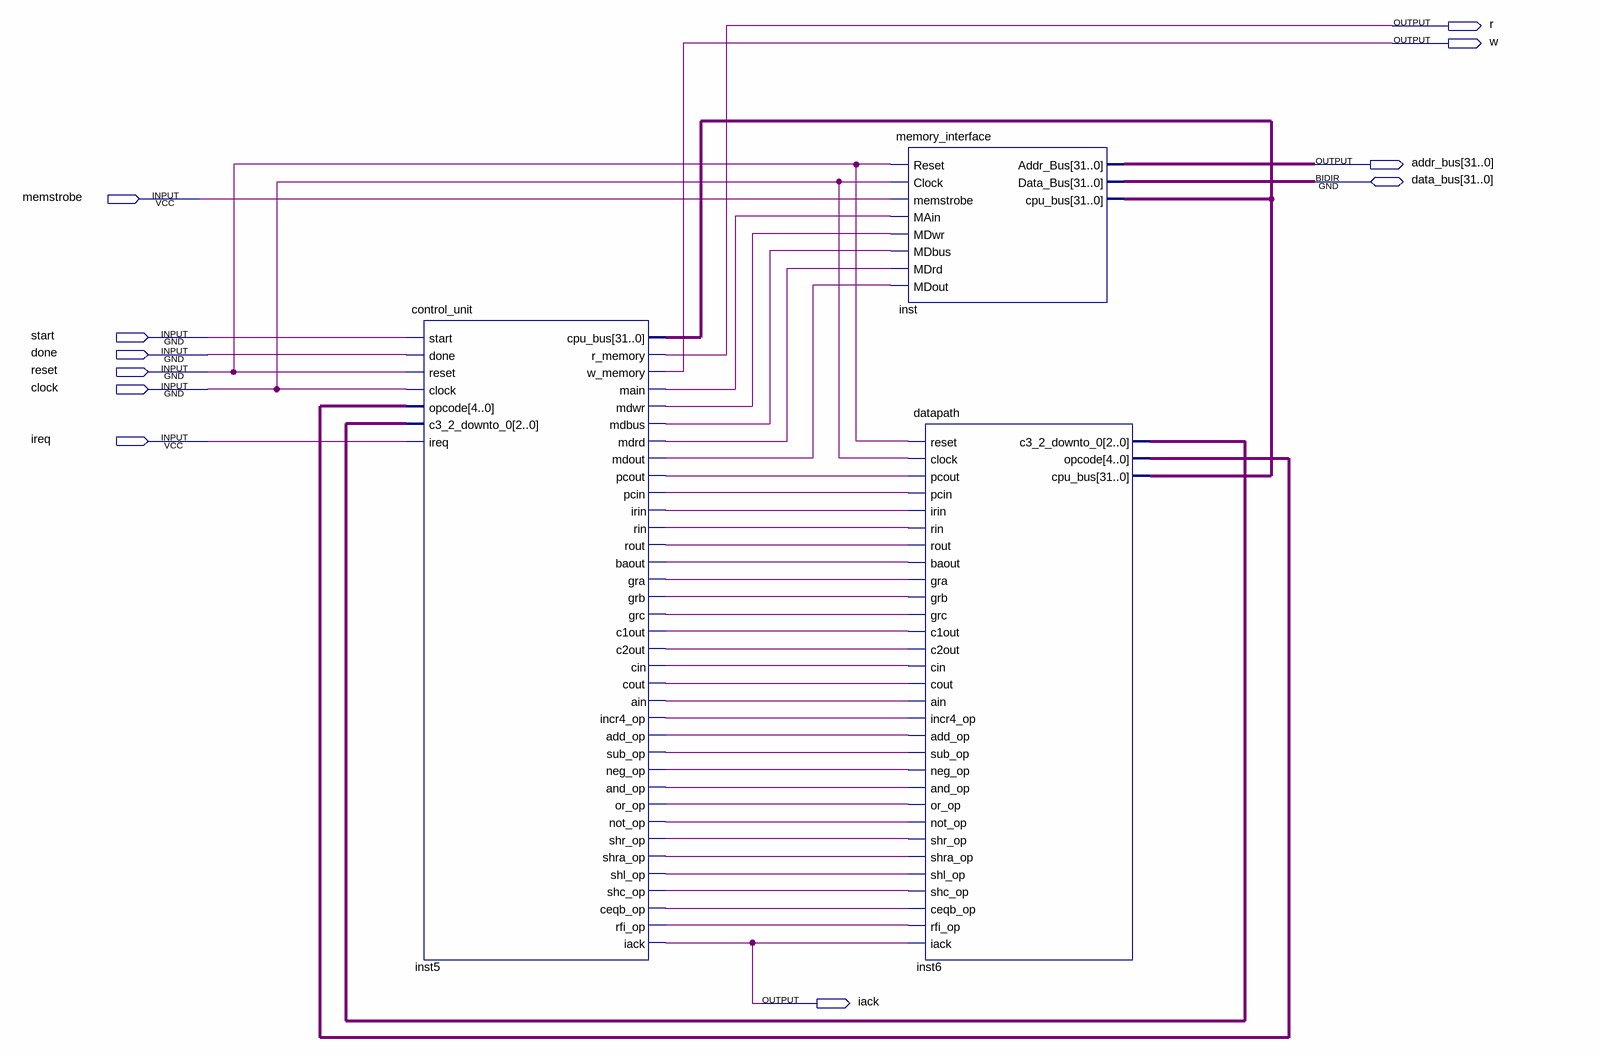
[diagram p0: schematic sheet]
// Quartus schematic cpu.bdf as structural Verilog: 3 symbols, 11 pins
module cpu (
  input  memstrobe,
  input  start,
  input  done,
  input  reset,
  input  clock,
  input  ireq,
  inout  [31:0] data_bus,
  output r,
  output w,
  output [31:0] addr_bus,
  output iack
);

  wire inst5_add_op, inst5_ain, inst5_and_op, inst5_baout, inst5_c1out, inst5_c2out, inst5_ceqb_op,
       inst5_cin, inst5_cout, inst5_gra, inst5_grb, inst5_grc, inst5_incr4_op, inst5_irin, inst5_main,
       inst5_mdbus, inst5_mdout, inst5_mdrd, inst5_mdwr, inst5_neg_op, inst5_not_op, inst5_or_op, inst5_pcin,
       inst5_pcout, inst5_rfi_op, inst5_rin, inst5_rout, inst5_shc_op, inst5_shl_op, inst5_shr_op,
       inst5_shra_op, inst5_sub_op;
  wire [2:0] inst6_c3_2_downto_0;
  wire [4:0] inst6_opcode;
  wire [31:0] inst5_cpu_bus;

  control_unit inst5 (
    .start(start), .done(done), .reset(reset), .clock(clock), .opcode(inst6_opcode),
    .c3_2_downto_0(inst6_c3_2_downto_0), .ireq(ireq), .r_memory(r), .w_memory(w), .main(inst5_main),
    .mdwr(inst5_mdwr), .mdbus(inst5_mdbus), .mdrd(inst5_mdrd), .mdout(inst5_mdout), .pcout(inst5_pcout),
    .pcin(inst5_pcin), .irin(inst5_irin), .rin(inst5_rin), .rout(inst5_rout), .baout(inst5_baout),
    .gra(inst5_gra), .grb(inst5_grb), .grc(inst5_grc), .c1out(inst5_c1out), .c2out(inst5_c2out),
    .cin(inst5_cin), .cout(inst5_cout), .ain(inst5_ain), .incr4_op(inst5_incr4_op), .add_op(inst5_add_op),
    .sub_op(inst5_sub_op), .neg_op(inst5_neg_op), .and_op(inst5_and_op), .or_op(inst5_or_op),
    .not_op(inst5_not_op), .shr_op(inst5_shr_op), .shra_op(inst5_shra_op), .shl_op(inst5_shl_op),
    .shc_op(inst5_shc_op), .ceqb_op(inst5_ceqb_op), .rfi_op(inst5_rfi_op), .iack(iack),
    .cpu_bus(inst5_cpu_bus));
  memory_interface inst (
    .Reset(reset), .Clock(clock), .memstrobe(memstrobe), .MAin(inst5_main), .MDwr(inst5_mdwr),
    .MDbus(inst5_mdbus), .MDrd(inst5_mdrd), .MDout(inst5_mdout), .Addr_Bus(addr_bus), .Data_Bus(data_bus),
    .cpu_bus(inst5_cpu_bus));
  datapath inst6 (
    .reset(reset), .clock(clock), .pcout(inst5_pcout), .pcin(inst5_pcin), .irin(inst5_irin), .rin(inst5_rin),
    .rout(inst5_rout), .baout(inst5_baout), .gra(inst5_gra), .grb(inst5_grb), .grc(inst5_grc),
    .c1out(inst5_c1out), .c2out(inst5_c2out), .cin(inst5_cin), .cout(inst5_cout), .ain(inst5_ain),
    .incr4_op(inst5_incr4_op), .add_op(inst5_add_op), .sub_op(inst5_sub_op), .neg_op(inst5_neg_op),
    .and_op(inst5_and_op), .or_op(inst5_or_op), .not_op(inst5_not_op), .shr_op(inst5_shr_op),
    .shra_op(inst5_shra_op), .shl_op(inst5_shl_op), .shc_op(inst5_shc_op), .ceqb_op(inst5_ceqb_op),
    .rfi_op(inst5_rfi_op), .iack(iack), .c3_2_downto_0(inst6_c3_2_downto_0), .opcode(inst6_opcode),
    .cpu_bus(inst5_cpu_bus));
endmodule
